# EAGLE design tracy (EAGLE 6.5.0)
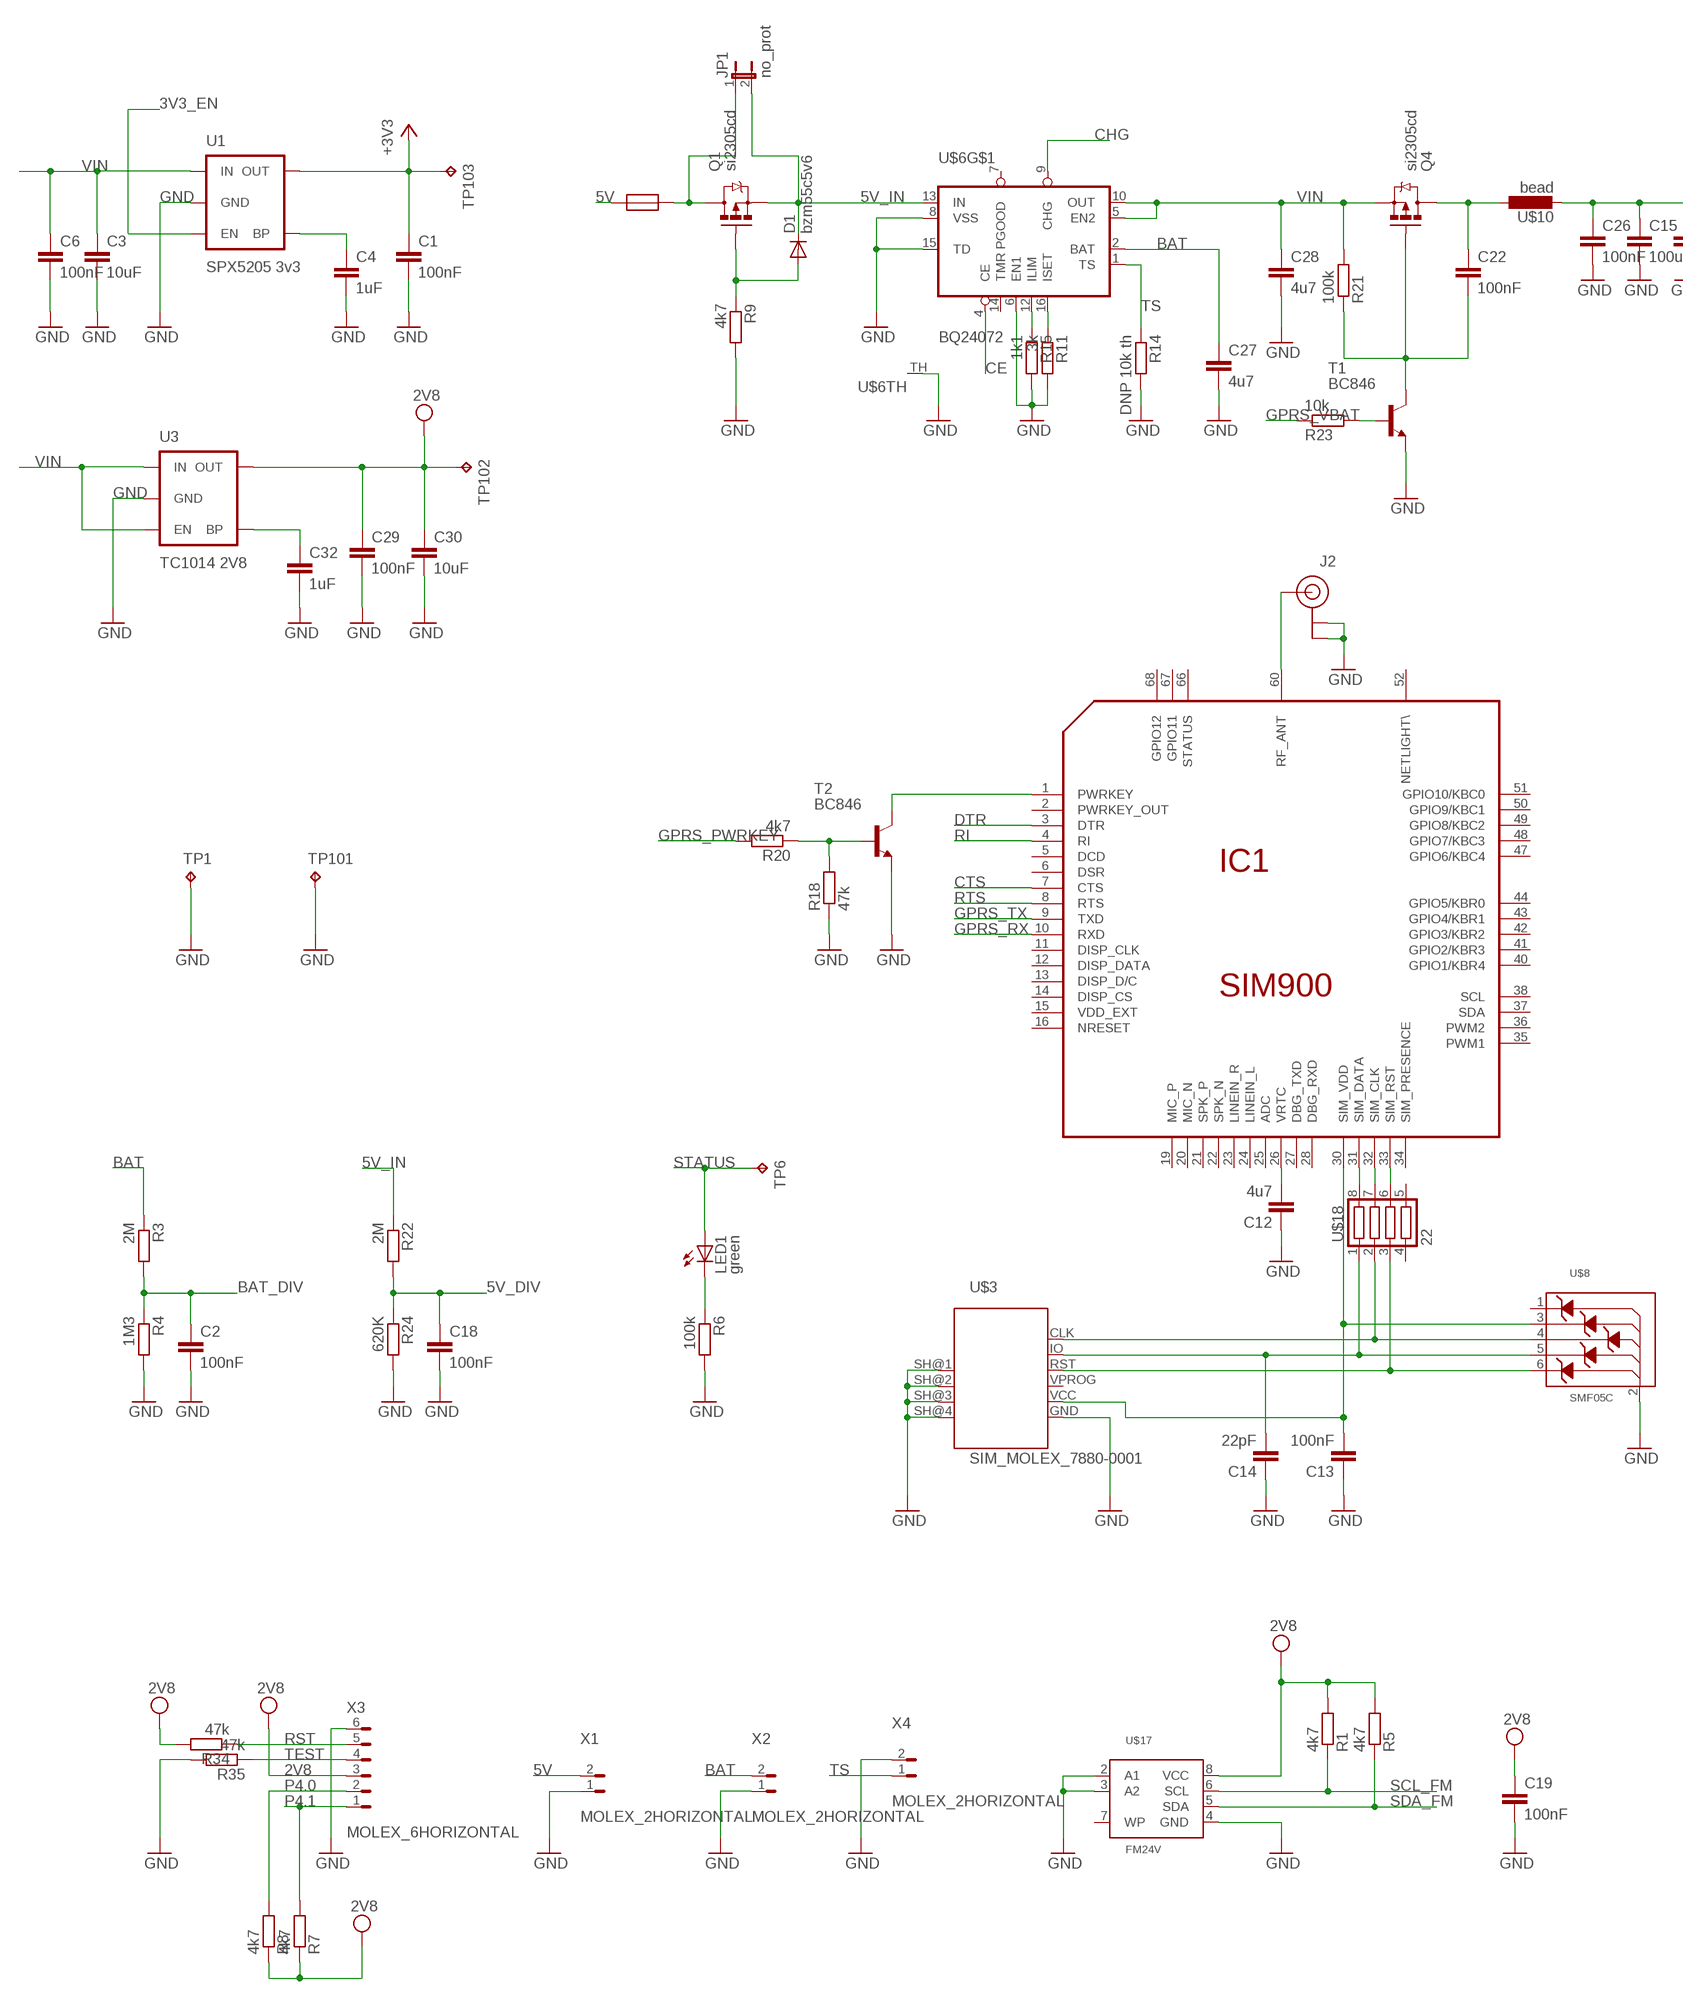
[diagram p0: schematic, sheet 1, part 1 of 2]
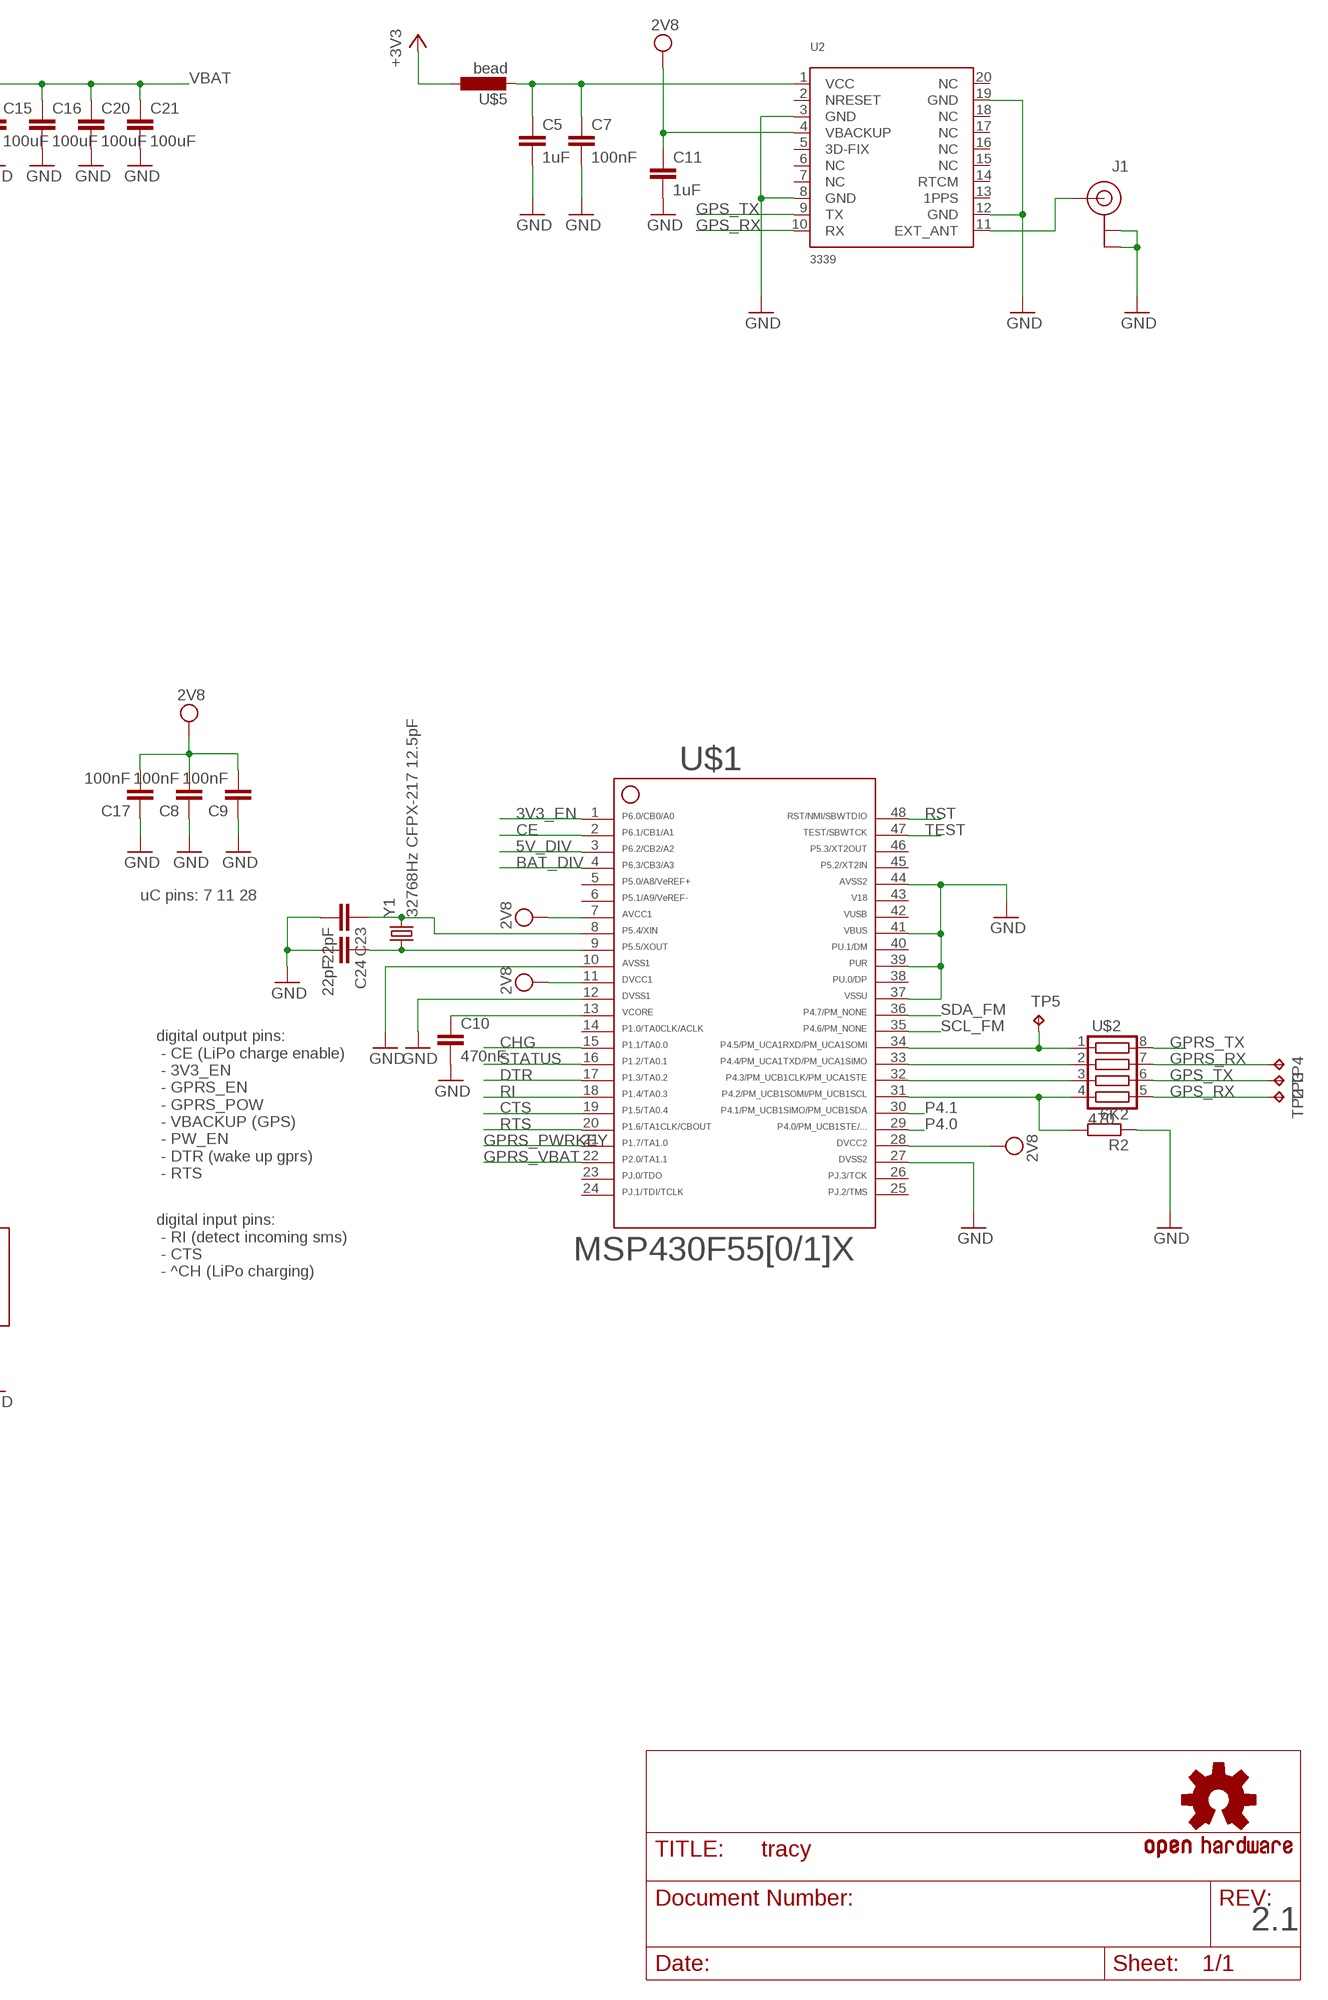
[diagram p1: schematic, sheet 1, part 2 of 2]

## Parts
C1  100nF  C-EUC0805  [C0805]
C2  100nF  C-EUC0805  [C0805]
C3  10uF  C-EUC0805  [C0805]
C4  1uF  C-EUC0805  [C0805]
C5  1uF  C-EUC0805  [C0805]
C6  100nF  C-EUC0805  [C0805]
C7  100nF  C-EUC0805  [C0805]
C8  100nF  C-EUC0805  [C0805]
C9  100nF  C-EUC0805  [C0805]
C10  470nF  C-EUC0805  [C0805]
C11  1uF  C-EUC0805  [C0805]
C12  4u7  C-EUC0805  [C0805]
C13  100nF  C-EUC0805  [C0805]
C14  22pF  C-EUC0805  [C0805]
C15  100uF  C-EUC1206  [C1206]
C16  100uF  C-EUC1206  [C1206]
C17  100nF  C-EUC0805  [C0805]
C18  100nF  C-EUC0805  [C0805]
C19  100nF  C-EUC0805  [C0805]
C20  100uF  C-EUC1206  [C1206]
C21  100uF  C-EUC1206  [C1206]
C22  100nF  C-EUC0805  [C0805]
C23  22pF  C-EUC0805  [C0805]
C24  22pF  C-EUC0805  [C0805]
C26  100nF  C-EUC0805  [C0805]
C27  4u7  C-EUC1206  [C1206]
C28  4u7  C-EUC1206  [C1206]
C29  100nF  C-EUC0805  [C0805]
C30  10uF  C-EUC1206  [C1206]
C32  1uF  C-EUC0805  [C0805]
D1  bzm55c5v6  DIODE-MICROMELF-W  [MICROMELF-W]
IC1  SIM900  [SIM900]
J1  U.FL  [U.FL]
J2  U.FL  [U.FL]
JP1  no_prot  JUMPER-2SMD-NO  [SJ_2S-NO]
LED1  green  LEDCHIPLED_0805  [CHIPLED_0805]
Q1  si2305cd  MOSFET-PCHANNELSMD_POWER  [SOT23-3_POWER]
Q4  si2305cd  MOSFET-PCHANNELSMD_POWER  [SOT23-3_POWER]
R1  4k7  R-EU_R0805W  [R0805W]
R2  6K2  R-EU_R0805W  [R0805W]
R3  2M  R-EU_R0805W  [R0805W]
R4  1M3  R-EU_R0805W  [R0805W]
R5  4k7  R-EU_R0805W  [R0805W]
R6  100k  R-EU_R0805W  [R0805W]
R7  4k7  R-EU_R0805W  [R0805W]
R8  4k7  R-EU_R0805W  [R0805W]
R9  4k7  R-EU_R0805W  [R0805W]
R11  3k  R-EU_R0805W  [R0805W]
R14  DNP 10k th  R-EU_R0805W  [R0805W]
R15  1k1  R-EU_R0805W  [R0805W]
R18  47k  R-EU_R0805W  [R0805W]
R20  4k7  R-EU_R0805W  [R0805W]
R21  100k  R-EU_R0805W  [R0805W]
R22  2M  R-EU_R0805W  [R0805W]
R23  10k  R-EU_R0805W  [R0805W]
R24  620K  R-EU_R0805W  [R0805W]
R34  47k  R-EU_R0805W  [R0805W]
R35  47k  R-EU_R0805W  [R0805W]
T1  BC846  [SOT23]
T2  BC846  [SOT23]
TP1  TPTP12R  [TP12R]
TP2  TPTP12R  [TP12R]
TP3  TPTP12R  [TP12R]
TP4  TPTP12R  [TP12R]
TP5  TPTP12R  [TP12R]
TP6  TPTP12R  [TP12R]
TP101  TPTP12R  [TP12R]
TP102  TPTP12R  [TP12R]
TP103  TPTP12R  [TP12R]
U1  SPX5205 3v3  V_REG_LDOSMD  [SOT23-5]
U2  3339  GPS_FGPMMOPA6H  [FGPMMOPA6H]
U3  TC1014 2V8  V_REG_LDOSMD  [SOT23-5]
U$1  MSP430F5510  F55[0/1]X---PT48  [PT48]
U$2  470  RES_ARR  [YC164]
U$3  SIM_MOLEX_7880-0001  [MOLEX_7880-0001]
U$5  bead  INDUCTOR  [L0805W]
U$6  BQ24072  [S-PVQFN-N16]
U$7  OSHW-LOGOM  [OSHW-LOGO-M]
U$8  SMF05C  [SC-88]
U$9  RESETTABLE_0805  [0805W]
U$10  bead  INDUCTOR  [L0805W]
U$17  FM24V  [SO-08]
U$18  22  RES_ARR  [YC164]
X1  MOLEX_2HORIZONTAL  [0530480210]
X2  MOLEX_2HORIZONTAL  [0530480210]
X3  MOLEX_6HORIZONTAL  [0530480610]
X4  MOLEX_2HORIZONTAL  [0530480210]
Y1  32768Hz CFPX-217 12.5pF  CRYSTAL3.2X1.5  [CRYSTAL-SMD-3.2X1.5]

## Nets
2V8: C8.2 C9.2 C11.1 C17.2 C19.1 C29.1 C30.1 R1.2 R5.2 R7.1 R8.1 R34.2 TP102.TP U2.4(VBACKUP) U3.5(OUT) U$1.7 U$1.11 U$1.28 U$17.8(VCC) X3.3
3V3_EN: U1.3(EN) U$1.1
5V: U$9.1 X1.2
5V_DIV: C18.1 R22.2 R24.1 U$1.3
5V_IN: D1.C JP1.2 Q1.2(S) R22.1 U$6.13(IN)
+3V3: C1.1 TP103.TP U1.5(OUT) U$5.1
BAT: C27.1 R3.1 U$6.2(BAT) X2.2
BAT_DIV: C2.1 R3.2 R4.1 U$1.4
CE: U$1.2 U$6.4(CE)
CHG: U$1.15 U$6.9(CHG)
CTS: IC1.7(CTS) U$1.19
DTR: IC1.3(DTR) U$1.17
GND: C1.2 C2.2 C3.2 C4.2 C5.2 C6.2 C7.2 C8.1 C9.1 C10.2 C11.2 C12.1 C13.1 C14.1 C15.2 C16.2 C17.1 C18.2 C19.2 C20.2 C21.2 C23.2 C24.2 C26.2 C27.2 C28.2 C29.2 C30.2 C32.2 J1.P$1(GND) J1.P$2(GND) J2.P$1(GND) J2.P$2(GND) R2.1 R4.2 R6.2 R9.2 R11.2 R14.2 R15.2 R18.1 R24.2 R35.2 T1.2(E) T2.2(E) TP1.TP TP101.TP U1.2(GND) U2.3(GND) U2.8(GND) U2.12(GND) U2.19(GND) U3.2(GND) U$1.10 U$1.12 U$1.27 U$1.37 U$1.39 U$1.41 U$1.44 U$3.GND U$3.SH@1(SH) U$3.SH@2(SH) U$3.SH@3(SH) U$3.SH@4(SH) U$6.6(EN1) U$6.8(VSS) U$6.15(TD) U$6.TH(TH:TH) U$8.2(ANODE) U$17.2(A1) U$17.3(A2) U$17.4(GND) X1.1 X2.1 X3.6 X4.2
GPRS_PWRKEY: R20.2 U$1.21
GPRS_RX: IC1.10(RXD) TP4.TP U$2.7
GPRS_TX: IC1.9(TXD) U$2.8
GPRS_VBAT: R23.1 U$1.22
GPS_RX: TP2.TP U2.10(RX) U$2.5
GPS_TX: TP3.TP U2.9(TX) U$2.6
GPS_VCC: C5.1 C7.1 U2.1(VCC) U$5.2
N$1: U$1.32 U$2.3
N$2: C4.1 U1.4(BP)
N$3: R2.2 U$1.31 U$2.4
N$4: U$1.33 U$2.2
N$5: JP1.1 Q1.3(D) U$9.2
N$6: C10.1 U$1.13
N$7: R23.2 T1.1(B)
N$8: LED1.C R6.1
N$9: J1.P$3(SIGNAL) U2.11(EXT_ANT)
N$10: TP5.TP U$1.34 U$2.1
N$11: D1.A Q1.1(G) R9.1
N$17: IC1.31(SIM_DATA) U$18.8
N$18: IC1.32(SIM_CLK) U$18.7
N$19: IC1.33(SIM_RST) U$18.6
N$25: C24.1 U$1.9 Y1.P$1
N$26: C23.1 U$1.8 Y1.P$2
N$27: R11.1 U$6.16(ISET)
N$33: R15.1 U$6.12(ILIM)
N$45: R18.2 R20.1 T2.1(B)
N$46: IC1.60(RF_ANT) J2.P$3(SIGNAL)
N$48: C22.2 Q4.1(G) R21.1 T1.3(C)
N$49: C22.1 Q4.3(D) U$10.1
N$50: C32.1 U3.4(BP)
P4.0: R8.2 U$1.29 X3.2
P4.1: R7.2 U$1.30 X3.1
PWRKEY: IC1.1(PWRKEY) T2.3(C)
RI: IC1.4(RI) U$1.18
RST: R34.1 U$1.48 X3.5
RTS: IC1.8(RTS) U$1.20
SCL_FM: R1.1 U$1.35 U$17.6(SCL)
SDA_FM: R5.1 U$1.36 U$17.5(SDA)
SIM_VCC: C13.2 IC1.30(SIM_VDD) U$3.VCC U$8.3(CATODE2)
SIMLOCK_CLK: U$3.CLK U$8.4(CATODE3) U$18.2
SIMLOCK_IO: C14.2 U$3.IO U$8.5(CATODE4) U$18.1
SIMLOCK_RST: U$3.RST U$8.6(CATODE5) U$18.3
STATUS: LED1.A TP6.TP U$1.16
TEST: R35.1 U$1.47 X3.4
TS: R14.1 U$6.1(TS) X4.1
VBAT: C15.1 C16.1 C20.1 C21.1 C26.1 U$10.2
VIN: C3.1 C6.1 C28.1 Q4.2(S) R21.2 U1.1(IN) U3.1(IN) U3.3(EN) U$6.5(EN2) U$6.10(OUT)
VRTC: C12.2 IC1.26(VRTC)
Unconnected: IC1.2(PWRKEY_OUT) IC1.5(DCD) IC1.6(DSR) IC1.11(DISP_CLK) IC1.12(DISP_DATA) IC1.13(DISP_D/C) IC1.14(DISP_CS) IC1.15(VDD_EXT) IC1.16(NRESET) IC1.19(MIC_P) IC1.20(MIC_N) IC1.21(SPK_P) IC1.22(SPK_N) IC1.23(LINEIN_R) IC1.24(LINEIN_L) IC1.25(ADC) IC1.27(DBG_TXD) IC1.28(DBG_RXD) IC1.34(SIM_PRESENCE) IC1.35(PWM1) IC1.36(PWM2) IC1.37(SDA) IC1.38(SCL) IC1.40(GPIO1/KBR4) IC1.41(GPIO2/KBR3) IC1.42(GPIO3/KBR2) IC1.43(GPIO4/KBR1) IC1.44(GPIO5/KBR0) IC1.47(GPIO6/KBC4) IC1.48(GPIO7/KBC3) IC1.49(GPIO8/KBC2) IC1.50(GPIO9/KBC1) IC1.51(GPIO10/KBC0) IC1.52(NETLIGHT\) IC1.66(STATUS) IC1.67(GPIO11) IC1.68(GPIO12) U2.2(NRESET) U2.5(3D-FIX) U2.6(NC) U2.7(NC) U2.13(1PPS) U2.14(RTCM) U2.15(NC) U2.16(NC) U2.17(NC) U2.18(NC) U2.20(NC) U$1.5 U$1.6 U$1.14 U$1.23 U$1.24 U$1.25 U$1.26 U$1.38 U$1.40 U$1.45 U$3.VPROG U$6.7(PGOOD) U$6.14(TMR) U$8.1(CATODE1) U$17.7(WP) U$18.4 U$18.5

## Notes on the sheet
- uC pins: 7 11 28
- digital output pins: 
   - CE (LiPo charge enable)
   - 3V3_EN
   - GPRS_EN
   - GPRS_POW
   - VBACKUP (GPS)
   - PW_EN
   - DTR (wake up gprs)
   - RTS
- digital input pins:
   - RI (detect incoming sms)
   - CTS
   - ^CH (LiPo charging)
- 2.1

## Power pins joined to a net without a drawn wire
42: U$1.42
43: U$1.43
46: U$1.46
GND: IC1.17(GND) IC1.18(GND) IC1.29(GND) IC1.39(GND) IC1.45(GND) IC1.46(GND) IC1.53(GND) IC1.54(GND) IC1.58(GND) IC1.59(GND) IC1.61(GND) IC1.62(GND) IC1.63(GND) IC1.64(GND) IC1.65(GND)
VBAT: IC1.55(VBAT) IC1.56(VBAT) IC1.57(VBAT)

## Library data of the parts
C1-C24 C26-C30 C32 = rcl:C-EU: CAPACITOR, European symbol
D1 = diode:DIODE-: DIODE
IC1 = Simplex-ICs:SIM900: SIM900
J1 J2 = SparkFun-Connectors:U.FL: SMD antenna connector- WRL-09144
JP1 = SparkFun-Passives:JUMPER-2: Jumper Basic 0.1" spaced jumper. Use with breakaway headers.
LED1 = led:LED: LED OSRAM: - CHIPLED LG R971, LG N971, LY N971, LG Q971, LY Q971, LO R971, LY R971 LH N974, LH R974 LS Q976, LO Q976, LY Q976 LO Q996 - Hyper CHIPLED LW Q18S LB Q993, LB Q99A, LB R99A - SideLED LS A670, LO A670, LY A670, LG A670, LP A670 LB A673, LV A673, LT A673, LW A673 LH A674 LY A675 LS A676, LA A676, LO A676, LY A676, LW A676 LS A679, LY A679, LG A679 - Hyper Micro SIDELED® LS Y876, LA Y876, LO Y876, LY Y876 LT Y87S - SmartLED LW L88C, LW L88S LB L89C, LB L89S, LG L890 LS L89K, LO L89K, LY L89K LS L896, LA L896, LO L896, LY L896 - TOPLED LS T670, LO T670, LY T670, LG T670, LP T670 LSG T670, LSP T670, LSY T670, LOP T670, LYG T670 LG T671, LOG T671, LSG T671 LB T673, LV T673, LT T673, LW T673 LH T674 LS T676, LA T676, LO T676, LY T676, LB T676, LH T676, LSB T676, LW T676 LB T67C, LV T67C, LT T67C, LS T67K, LO T67K, LY T67K, LW E67C LS E67B, LA E67B, LO E67B, LY E67B, LB E67C, LV E67C, LT E67C LW T67C LS T679, LY T679, LG T679 LS T770, LO T770, LY T770, LG T770, LP T770 LB T773, LV T773, LT T773, LW T773 LH T774 LS E675, LA E675, LY E675, LS T675 LS T776, LA T776, LO T776, LY T776, LB T776 LHGB T686 LT T68C, LB T68C - Hyper Mini TOPLED® LB M676 - Mini TOPLED Santana® LG M470 LS M47K, LO M47K, LY M47K Source: http://www.osram.convergy.de LUXEON: - LUMILED® LXK2-PW12-R00, LXK2-PW12-S00, LXK2-PW14-U00, LXK2-PW14-V00 LXK2-PM12-R00, LXK2-PM12-S00, LXK2-PM14-U00 LXK2-PE12-Q00, LXK2-PE12-R00, LXK2-PE12-S00, LXK2-PE14-T00, LXK2-PE14-U00 LXK2-PB12-K00, LXK2-PB12-L00, LXK2-PB12-M00, LXK2-PB14-N00, LXK2-PB14-P00, LXK2-PB14-Q00 LXK2-PR12-L00, LXK2-PR12-M00, LXK2-PR14-Q00, LXK2-PR14-R00 LXK2-PD12-Q00, LXK2-PD12-R00, LXK2-PD12-S00 LXK2-PH12-R00, LXK2-PH12-S00 LXK2-PL12-P00, LXK2-PL12-Q00, LXK2-PL12-R00 Source: www.luxeon.com KINGBRIGHT: KA-3528ASYC Source: www.kingbright.com
Q1 Q4 = Simplex-DiscreteSemi:MOSFET-PCHANNEL: Generic PMOSFET
R1-R9 R11 R14 R15 R18 R20-R24 R34 R35 = rcl:R-EU_: RESISTOR, European symbol
T1 T2 = transistor:BC846: NPN TRANSISTOR
TP1-TP6 TP101-TP103 = testpad:TP: Test pad
U1 U3 = SparkFun:V_REG_LDO: Voltage Regulator LDO Standard 150mA LDO voltage regulator in SOT-23 layout. Micrel part MIC5205. BP (by-pass) pin is used to lower output noise with 470pF cap.
U2 = Simplex-ICs:GPS_FGPMMOPA6H: GPS Module - MTK MT3339 Chipset, -165dBm sensitivity, 22 channels, 10Hz, auto-select external antenna options
U$1 = TI_MSP430_v16:F55[0/1]X---PT48: ***F55[0/1/2]X*** PT48 Rev. 1.0 06/2010 "http://www.ti.com/lit/gpn/msp430f5509" Only for FF5504, F5508,F5509,F5510
U$2 U$18 = Simplex-rlc:RES_ARR: resistor chip array yageo YC164 series (8pin/4R)
U$3 = Simplex-Connectors:SIM: SIM card holders without lock detection
U$5 U$10 = Simplex-rlc:INDUCTOR: smd inductors
U$6 = Simplex-ICs:BQ24072: TI BQ24072 - Li battery charger and power path management ic
U$7 = SparkFun:OSHW-LOGO: Open Source Hardware Logo This logo indicates the piece of hardware it is found on incorporates a OSHW license and/or adheres to the definition of open source hardware found here: http://freedomdefined.org/OSHW
U$8 = Simplex-DiscreteSemi:SMF05C: ON Semiconductor SMF05C 5-line transient voltage suppressor array
U$9 = Simplex-Fuses:RESETTABLE: resettable fuse
U$17 = Simplex-ICs:FM24V: CYPRESS FM24Vxx serial f-ram
X1 X2 X4 = Simplex-Connectors:MOLEX_2: Molex 2 pin connectors 1.25mm PicoBlade
X3 = Simplex-Connectors:MOLEX_6: Molex 6 pin connectors 1.25mm PicoBlade
Y1 = Simplex-FreqCtrl:CRYSTAL: smd crystals

## Net classes
1 vcc: width 0.203 mm

## Board
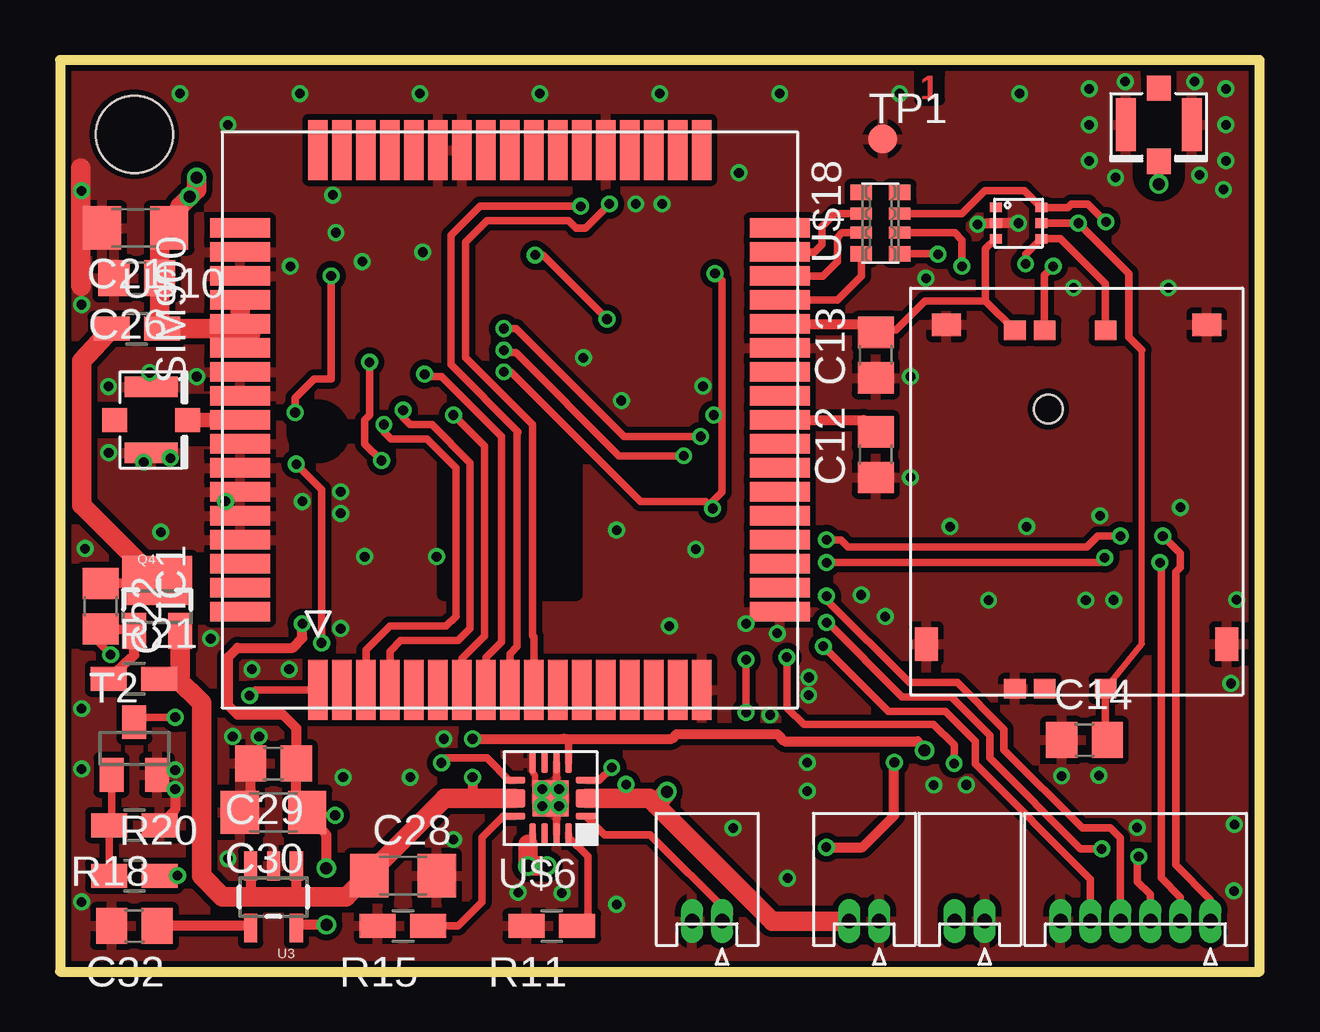
[diagram p2: board, top side]
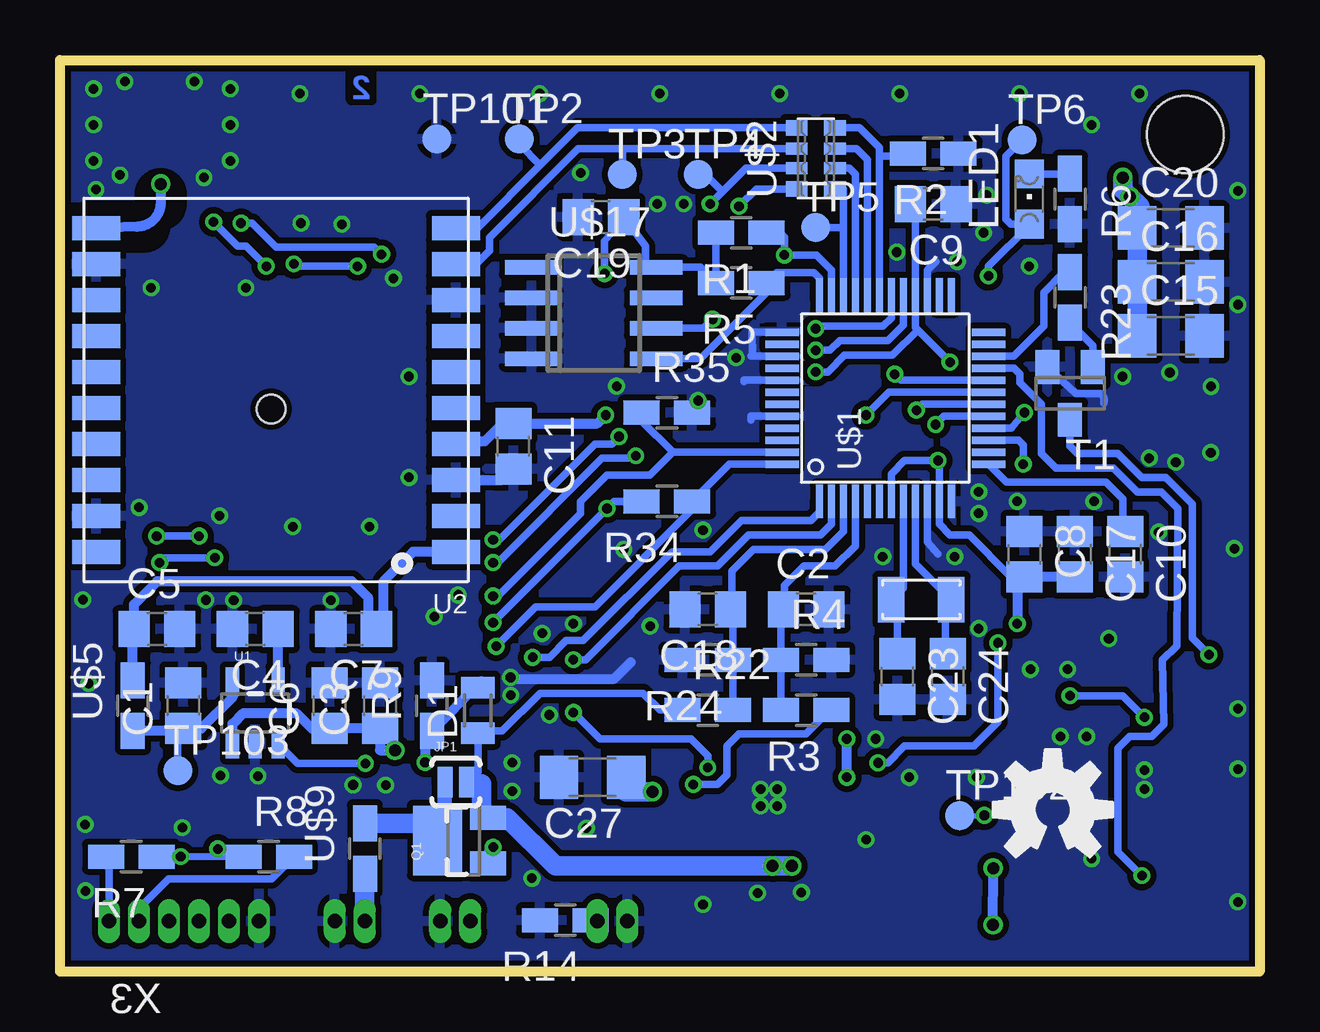
[diagram p3: board, bottom side, seen from below]

Size 50 x 38 mm. Coordinates in mm from the lower left corner, seen from the top.
Outline: 0,0 50,0 50,38 0,38 0,0
Copper layers (1*16): Top 0.035mm / dielectric 1.5mm / Bottom 0.035mm
Design rules "seeedstudio_rules_v1.1 *": minimum track width 6mil, minimum drill 12mil, track to track 6mil, track to pad 6mil, pad to pad 6mil, via to via 6mil, smd to smd 0mil, copper to edge 10mil, drill to drill 10mil, minimum pad ring 0.154mm, minimum via ring 6mil, stop-mask expansion 2mil, vias tented up to drill 100mil, thermal gap 10mil
Holes 3.2 mm at 3.1,34.9
tRestrict: 2 lines
bRestrict: 2 lines

### Footprints (pad centres in the part's own frame; a part is rotated, then mirrored left to right if it is on the bottom)
C0805 = smd 1.3 x 1.5: 1 -0.95,0; 2 0.95,0
C1206 = smd 1.6 x 1.8: 1 -1.4,0; 2 1.4,0
MICROMELF-W = smd 0.9 x 1.4: A 0.95,0; C -0.95,0
SIM900 = smd 2.5 x 0.8: 1 -11.25,8; 2 -11.25,7; 3 -11.25,6; 4 -11.25,5; 5 -11.25,4; 6 -11.25,3; 7 -11.25,2; 8 -11.25,1; 9 -11.25,0; 10 -11.25,-1; 11 -11.25,-2; 12 -11.25,-3; 13 -11.25,-4; 14 -11.25,-5; 15 -11.25,-6; 16 -11.25,-7; 17 -11.25,-8; 35 11.25,-8; 36 11.25,-7; 37 11.25,-6; 38 11.25,-5; 39 11.25,-4; 40 11.25,-3; 41 11.25,-2; 42 11.25,-1; 43 11.25,0; 44 11.25,1; 45 11.25,2; 46 11.25,3; 47 11.25,4; 48 11.25,5; 49 11.25,6; 50 11.25,7; 51 11.25,8 | smd 0.8 x 2.5: 18 -8,-11.25; 19 -7,-11.25; 20 -6,-11.25; 21 -5,-11.25; 22 -4,-11.25; 23 -3,-11.25; 24 -2,-11.25; 25 -1,-11.25; 26 0,-11.25; 27 1,-11.25; 28 2,-11.25; 29 3,-11.25; 30 4,-11.25; 31 5,-11.25; 32 6,-11.25; 33 7,-11.25; 34 8,-11.25; 52 8,11.25; 53 7,11.25; 54 6,11.25; 55 5,11.25; 56 4,11.25; 57 3,11.25; 58 2,11.25; 59 1,11.25; 60 0,11.25; 61 -1,11.25; 62 -2,11.25; 63 -3,11.25; 64 -4,11.25; 65 -5,11.25; 66 -6,11.25; 67 -7,11.25; 68 -8,11.25
U.FL = smd 2.2 x 0.85: P$1 0,1.375; P$2 0,-1.375 | smd 1.05 x 1: P$3 1.525,0; P$4 -1.525,0
SJ_2S-NO = smd 0.635 x 1.27: 1 -0.45,0; 2 0.45,0
CHIPLED_0805 = smd 1.2 x 1.2: A 0,-1.05; C 0,1.05
SOT23-3_POWER = smd 1 x 1.5: 1 -0.939,-1.384; 2 0.961,-1.384 | smd 2.9 x 2.05: 3 0.011,0.716
R0805W = smd 1.5 x 1: 1 -1.052,0; 2 1.052,0
SOT23 = smd 1 x 1.4: 1 -0.95,-1.1; 2 0.95,-1.1; 3 0,1.1
TP12R = smd 1.2 x 1.2: TP 0,0
SOT23-5 = smd 0.55 x 1.2: 1 -0.95,-1.3; 2 0,-1.3; 3 0.95,-1.3; 4 0.95,1.3; 5 -0.95,1.3
FGPMMOPA6H = smd 2 x 1: 1 0.5,14.75; 2 0.5,13.25; 3 0.5,11.75; 4 0.5,10.25; 5 0.5,8.75; 6 0.5,7.25; 7 0.5,5.75; 8 0.5,4.25; 9 0.5,2.75; 10 0.5,1.25; 11 15.5,1.25; 12 15.5,2.75; 13 15.5,4.25; 14 15.5,5.75; 15 15.5,7.25; 16 15.5,8.75; 17 15.5,10.25; 18 15.5,11.75; 19 15.5,13.25; 20 15.5,14.75 | hole 1.2: 8.2,8.8
PT48 = smd 1.4 x 0.3: 1 -4.3,2.75; 2 -4.3,2.25; 3 -4.3,1.75; 4 -4.3,1.25; 5 -4.3,0.75; 6 -4.3,0.25; 7 -4.3,-0.25; 8 -4.3,-0.75; 9 -4.3,-1.25; 10 -4.3,-1.75; 11 -4.3,-2.25; 12 -4.3,-2.75; 25 4.3,-2.75; 26 4.3,-2.25; 27 4.3,-1.75; 28 4.3,-1.25; 29 4.3,-0.75; 30 4.3,-0.25; 31 4.3,0.25; 32 4.3,0.75; 33 4.3,1.25; 34 4.3,1.75; 35 4.3,2.25; 36 4.3,2.75 | smd 0.3 x 1.4: 13 -2.75,-4.3; 14 -2.25,-4.3; 15 -1.75,-4.3; 16 -1.25,-4.3; 17 -0.75,-4.3; 18 -0.25,-4.3; 19 0.25,-4.3; 20 0.75,-4.3; 21 1.25,-4.3; 22 1.75,-4.3; 23 2.25,-4.3; 24 2.75,-4.3; 37 2.75,4.3; 38 2.25,4.3; 39 1.75,4.3; 40 1.25,4.3; 41 0.75,4.3; 42 0.25,4.3; 43 -0.25,4.3; 44 -0.75,4.3; 45 -1.25,4.3; 46 -1.75,4.3; 47 -2.25,4.3; 48 -2.75,4.3
YC164 = smd 0.65 x 0.9: 1 -1.275,-0.8; 4 1.275,-0.8; 5 1.275,0.8; 8 -1.275,0.8 | smd 0.5 x 0.9: 2 -0.4,-0.8; 3 0.4,-0.8; 6 0.4,0.8; 7 -0.4,0.8
MOLEX_7880-0001 = smd 0.8 x 0.9: CLK 1.77,8.13; GND 16.71,4.35; IO 16.71,8.13; RST 1.77,5.59; VCC 1.77,4.35; VPROG 16.71,5.59 | smd 0.95 x 1.2: SH@1 1.54,1.5; SH@4 1.54,12.35 | smd 1.4 x 0.95: SH@2 14.85,0.66; SH@3 14.85,13.18
L0805W = smd 1.5 x 1: 1 -1.052,0; 2 1.052,0
S-PVQFN-N16 = smd 0.85 x 0.28: 1 -0.725,2.225; 4 -0.725,0.725; 9 2.225,0.725; 12 2.225,2.225 | smd 0.85 x 0.78: 2 -0.725,1.475; 10 2.225,1.475 | smd 0.28 x 0.85: 5 0,0; 6 0.5,0; 7 1,0; 8 1.5,0; 13 1.5,2.95; 14 1,2.95; 15 0.5,2.95; 16 0,2.95 | smd 1.5 x 1.5: TH 0.75,1.475
SC-88 = smd 0.5 x 0.4: 1 0,1.3; 2 0,0.65; 3 0,0; 4 1.9,0; 5 1.9,0.65; 6 1.9,1.3
0805W = smd 1.5 x 1: 1 -1.052,0; 2 1.052,0
SO-08 = smd 0.6 x 2.2: 1 -1.905,-2.6; 2 -0.635,-2.6; 3 0.635,-2.6; 4 1.905,-2.6; 5 1.905,2.6; 6 0.635,2.6; 7 -0.635,2.6; 8 -1.905,2.6
0530480210 = drill 0.6 pad 0.9 long: 1 0,0; 2 1.25,0
0530480610 = drill 0.6 pad 0.9 long: 1 0,0; 2 1.25,0; 3 2.5,0; 4 3.75,0; 5 5,0; 6 6.25,0
CRYSTAL-SMD-3.2X1.5 = smd 1.1 x 1.9: P$1 -1.25,0; P$2 1.25,0

### Placement (x,y rotation side)
C1  44.86,11.08 90 bottom
C2  18.9,15.1 0 bottom
C3  36.66,11.08 90 bottom
C4  41.86,14.28 180 bottom
C5  45.96,14.28 0 bottom
C6  38.76,11.08 90 bottom
C7  37.76,14.28 180 bottom
C8  9.8,17.4 270 bottom
C9  13.6,32 180 bottom
C10  5.6,17.4 270 bottom
C11  31.1,21.9 270 bottom
C12  34,21.55 90 top
C13  34,25.7 90 top
C14  42.7,9.65 0 top
C15  3.7,26.5 0 bottom
C16  3.7,28.75 0 bottom
C17  7.7,17.4 270 bottom
C18  23,15.1 180 bottom
C19  27.45,31.45 180 bottom
C20  3.7,31 0 bottom
C21  3.15,31 180 top
C22  1.7,15.23 270 top
C23  15.1,12.3 270 bottom
C24  13,12.3 270 bottom
C26  3.2,28.9 180 top
C27  27.8,8.1 180 bottom
C28  14.3,4 0 top
C29  8.9,8.67 180 top
C30  8.9,6.64 180 top
C32  3.1,1.9 180 top
D1  32.58,10.89 90 bottom
IC1  18.75,23 90 top
J1  45.8,35.3 270 top
J2  3.8,23 0 top
JP1  33.5,7.9 0 bottom
LED1  9.6,32.2 0 bottom
Q1  33.55,5.45 90 bottom
Q4  4.04,15.59 0 top
R1  21.6,30.8 180 bottom
R2  13.6,34.1 180 bottom
R3  18.9,10.9 180 bottom
R4  18.9,13 0 bottom
R5  21.6,28.7 180 bottom
R6  7.9,32.2 270 bottom
R7  47.03,4.79 180 bottom
R8  41.3,4.79 0 bottom
R9  34.5,11.08 90 bottom
R11  20.5,1.9 180 top
R14  28.94,2.14 180 bottom
R15  14.3,1.9 180 top
R18  3.1,6.1 180 top
R20  3.1,4 0 top
R21  3.09,12.2 0 top
R22  23,10.9 0 bottom
R23  7.9,28.1 270 bottom
R24  23,13 180 bottom
R34  24.7,19.6 180 bottom
R35  24.7,23.3 0 bottom
T1  7.9,24.1 180 bottom
T2  3.1,9.3 0 top
TP1  34.3,34.7 0 top
TP2  30.85,34.7 0 bottom
TP3  26.56,33.23 0 bottom
TP4  23.39,33.23 0 bottom
TP5  18.5,31.02 0 bottom
TP6  9.9,34.67 0 bottom
TP101  34.3,34.7 0 bottom
TP102  12.5,6.5 0 bottom
TP103  45.09,8.37 0 bottom
U1  41.86,10.78 0 bottom
U2  33,32.25 180 bottom
U3  8.9,3.11 180 top
U$1  15.6,23.9 90 bottom
U$2  18.5,33.9 90 bottom
U$3  35.45,28.5 270 top
U$5  46.96,11.08 90 bottom
U$6  21.2,8.7 180 top
U$7  8.62,6.75 0 bottom
U$8  39,30.55 0 top
U$9  37.29,5.13 90 bottom
U$10  3.2,26.8 0 top
U$17  27.75,27.45 270 bottom
U$18  34.2,31.2 90 top
X1  38.55,2.1 180 top
X2  34.15,2.1 180 top
X3  47.95,2.1 180 top
X4  27.6,2.1 180 top
Y1  14.1,15.5 180 bottom

### Tracks (layer width: path | path; a pad name or v marks a point on that pad's centre or on a via)
2V8  (via drill 0.4, 0.5)
  Top 0.254: v11.47,6.51 C30.1
  Top 0.305: v12.9,25.4 12.9,23.2 12.7,23 12.7,22 v13.4,21.3 | v18.5,25 18.8,25 24.2,19.6 26.9,19.6 v27.2,19.3 27.2,19.6 27.6,20 27.6,22.95 | 27.6,22.95 27.6,28.8 v27.3,29.1 | v31.95,14.55 32,14.55 35.1,11.45 37.15,11.45 38.75,9.85 38.75,8.9 42.54,5.11 v43.42,5.11 | v27.25,23.2 27.35,23.2 27.6,22.95 | X3.3 45.44,3.21 44.91,3.74 44.91,4.79 v44.97,4.79
  Top 0.406: v10.1,14.5 10.1,13.9 9.7,13.5 7.4,13.5 7,13.1 7,11.1 7.4,10.7 9.3,10.7 9.85,10.15 C29.1 9.85,6.95 | C30.1 11.1,5.7 v11.1,4.31 | v11.11,1.95 9.99,1.95 U3.5
  Top 0.61: C30.1 9.85,6.95
  Bottom 0.254: TP102.TP v11.47,6.51
  Bottom 0.305: 14.25,26.75 14.35,26.85 U$1.28 14.35,32.1 C9.2 | 14.25,26.75 v12.9,25.4 | U$1.7 15.35,20.75 14.8,21.3 v13.4,21.3 13.35,21.3 U$1.11 13.35,18.65 12.9,18.2 12.1,18.2 10.4,16.5 9.85,16.5 C8.2 | v18.5,25 18,25 17.3,25.7 15.3,25.7 14.25,26.75 | R34.2 26.9,19.6 v27.2,19.3 v31.95,14.55 | R1.2 R5.2 23.31,29.36 U$17.8 25.6,29.3 25.6,30.25 C19.1 27.3,30.45 v27.3,29.1 | 43.45,4.8 v44.97,4.79 R7.1 | R8.1 43.45,4.8 | 43.45,4.8 43.42,4.83 v43.42,5.11
  Bottom 0.406: C17.2 C8.2 10.1,16.15 v10.1,14.5 | v11.11,1.95 v11.1,4.31 | U2.4 33.4,22.1 32.3,22.1 31.55,22.85 C11.1 27.6,22.85 v27.25,23.2
3V3_EN  (via drill 0.4)
  Top 0.305: v30.3,13.1 30.3,11 31,10.3 36.41,10.31 37.28,9.44 v37.27,8.67
  Bottom 0.305: U$1.1 18.35,19.15 18.7,18.8 21.6,18.8 22.9,17.5 24.5,17.5 28.2,13.8 28.9,13.8 29.6,13.1 v30.3,13.1 29.9,13.1 | v37.27,8.67 40.1,8.67 U1.3
5V
  Bottom 0.813: U$9.1 37.3,4.07 X1.2
5V_DIV
  Bottom 0.305: R22.2 R24.1 21.95,15 C18.1 22,15.15 22,16.7 21.1,17.6 18.1,17.6 17.35,18.35 U$1.3
5V_IN  (via drill 0.5)
  Top 0.305: 19.5,5.3 19.5,5.55 19.7,5.55 U$6.13
  Top 0.813: 19.5,5.3 v19.5,4.4 20,4.4
  Bottom 0.305: R22.1 25,10.9 25.7,11.6 30,11.6 31.57,10.03 32.48,10.03 D1.C 32.58,8.32 JP1.2
  Bottom 0.406: 32.43,6.46 Q1.2 | JP1.2 32.43,7.82
  Bottom 0.813: v19.5,4.4 v20.3,4.4 29.35,4.4 31.36,6.41 Q1.2 | 32.43,6.46 32.43,7.82
+3V3
  Bottom 0.305: TP103.TP 45.09,9.9 C1.1
  Bottom 0.406: U1.5 42.81,11.43 44.11,10.13 C1.1 44.96,10.03 U$5.1
BAT  (via drill 0.4, 0.5)
  Top 0.305: U$6.2 23.6,7.22 v23.6,7.8
  Top 0.813: U$6.2 24.57,7.22 24.85,6.95 | v25.3,7.5 24.85,6.95 | X2.2 29.7,2.1 24.85,6.95
  Bottom 0.305: R3.1 17.9,10.9 18.9,9.9 21.7,9.9 22.2,9.4 22.2,8.2 22.6,7.8 v23.6,7.8
  Bottom 0.813: C27.1 26.4,7.5 v25.3,7.5
BAT_DIV
  Bottom 0.305: R3.2 R4.1 19.95,15 C2.1 19.8,15.15 19.8,16.1 19,16.9 17.7,16.9 16.85,17.75 U$1.4
CE  (via drill 0.4)
  Top 0.305: U$6.4 22.48,7.97 v23,8.5 | v28.6,13 v28.6,10.8
  Bottom 0.305: U$1.2 17.85,18.65 18.3,18.2 21.3,18.2 22.6,16.9 24.2,16.9 28.1,13 v28.6,13 | v23,8.5 23,9 23.7,9.7 27.5,9.7 v28.6,10.8
CHG  (via drill 0.4)
  Top 0.305: v10.9,13.7 10.9,20.1 v9.85,21.15 | U$6.9 18.73,7.97 17.8,8.9 16.1,8.9 v15.9,8.7
  Bottom 0.305: U$1.15 10.05,22.15 9.85,21.95 v9.85,21.15 | v10.9,13.7 10.9,10.4 11.9,9.4 14.8,9.4 15.5,8.7 v15.9,8.7
CTS  (via drill 0.4)
  Top 0.305: v16.4,23.2 17.7,21.9 17.7,14 16.75,13.05 IC1.7
  Bottom 0.305: U$1.19 15.45,24.15 v16.4,23.2
DTR  (via drill 0.4)
  Top 0.305: v13.5,22.8 13.5,22.5 13.8,22.2 15.3,22.2 16.5,21 16.5,14.8 16.1,14.4 13.75,14.4 12.75,13.4 IC1.3
  Bottom 0.305: U$1.17 13.15,23.15 v13.5,22.8
GND  (via drill 0.4)
  Top 0.254: U$6.8 19.7,8.3 19.8,8.2 19.8,7.88 20,7.67
  Top 0.305: U$6.15 20.7,7.22 U$6.TH | U$6.TH 20,7.67 20,7.7 v20.1,7.6 20.4,7.3 | U$6.6 20.7,7.47 U$6.TH
  Top 0.406: C30.2 7.95,6.95 C29.2 | v4.8,7.6 4.8,6.75 R18.1 | v4.8,8.4 4.25,8.4 T2.2 | v39.95,31.2 U$8.2 38.25,31.2 38.2,31.15
  Top 0.813: 0.87,33.5 0.87,28.6 0.88,28.6 0.88,28.58
  Bottom 0.305: 13.4,17.4 13.85,17.9 U$1.10 13.85,19.7 | U$1.44 21.2,23.15 21.2,23 | U$1.27 13.85,29.25 13.5,29.6 | U$1.41 21.5,24.65 21.5,24.6 | U$1.39 21.19,25.65 | U$1.37 21.15,26.65 21.14,25.67 | T1.2 7.65,24.1 6.65,24.1 arc90 6.5,23.7
  Bottom 0.406: 31.28,12.2 26.9,12.2 26.2,12.9 | U2.3 31.55,20.5 C11.2
  other vias: 35,36.6 8.3,9.8 40,36.6 20.8,7.6 20.8,6.9 20.1,6.9 19.1,3.3 5.7,24.8 2.02,24.39 7.2,9.8 7,4.7 28.3,33.3 30,36.6 44,33.1 48.6,36.8 47.5,33.2 42.9,36.8 24,32 25.4,14.4 26.5,17.6 29.6,10.7 10.1,19.6 9.6,29.4 6.9,19.6 6.28,13.88 11.7,14.3 0.9,10.96 4.2,18.32 2.03,21.63 11.5,30.8 7,35.3 15,36.6 25,36.6 23.4,23.8 29.9,14.1 16.4,5.5 20.92,3.27 11.7,19.1 12.6,29.6 36.42,7.77 23.2,2.8 23.2,18.4 31.15,7.52 44.4,37.1 28.6,14.5 47.3,37.1 48.5,32.6 42.9,35.3 48.6,35.3 10,36.6 20,36.6 5,36.6 26.8,24.4 0.9,8.44 0.9,2.9 11.7,20 12.7,17.3 11.37,32.37 25.1,32 21.82,25.59 8,12.6 9.55,12.6 11.8,8.1 14.6,8.1 16,9.7 42.9,33.8 48.6,33.8 3.74,24.97 3.49,21.23 0.9,27.8 0.9,32.55 4.6,21.4 15.7,17.3 31.21,11.52 31.22,12.26 33.4,15.7 34.4,14.8 42.76,15.48 38.71,15.48 43.92,15.49 37.1,18.55 40.3,18.55 43.35,19 41.75,8.15 43.31,8.17 44.9,6 48.95,6.13 48.81,12.01 49.05,15.5 30.33,3.89 37.78,7.78 36.1,28.9 38.25,31.15 46.2,28.5 35.45,24.8 35.45,20.6 46.7,19.35 42.25,28.5 28.06,5.98 48.93,3.36 31.15,8.71 15.12,29.99 1.05,17.63
  pour Top (isolate 0.254): 0,38 50,38 50,0 0,0
  pour Bottom (isolate 0.254): 0,38 50,38 50,0 0,0
GPRS_PWRKEY  (via drill 0.4)
  Top 0.305: R20.2 v4.9,4
  Bottom 0.305: v4.9,4 5.9,5 5.9,9.3 5.4,9.8 4.5,9.8 4,10.3 4.05,12.98 3.45,13.58 3.4,19.3 4.1,20 5.1,20 6.1,21 8.5,21 9.1,21.6 9.1,23.65 10,24.55 10,24.9 10.25,25.15 U$1.21
GPRS_RX  (via drill 0.4)
  Top 0.305: v22.9,32 21.9,31 21.5,31 21.2,31.3 17.8,31.3 16.9,30.4 16.9,25.6 19.7,22.8 19.7,14 19.75,13.95 IC1.10
  Bottom 0.305: U$2.7 21.4,33.5 22.39,32.52 | 22.39,32.52 v22.9,32 | TP4.TP 23.11,33.24 22.39,32.52
GPRS_TX  (via drill 0.4)
  Top 0.305: v21.7,31.9 17.5,31.9 16.3,30.7 16.3,25.3 19.1,22.5 19.05,22.45 19.05,13.55 18.75,13.25 IC1.9
  Bottom 0.305: U$2.8 20.98,32.62 v21.7,31.9
GPRS_VBAT
  Bottom 0.305: U$1.22 10.25,25.65 9,26.9 9,28.3 8.15,29.15 R23.1 7.95,29.2
GPS_RX
  Bottom 0.305: U$2.5 28.43,35.17 29.98,33.62 | 29.98,33.62 32.6,31 U2.10 | TP2.TP 30.85,34.48 29.98,33.62
GPS_TX
  Bottom 0.305: U$2.6 26.59,34.3 | 26.59,34.3 28.4,34.3 32.1,30.6 32.1,30.05 32.7,29.45 33.45,29.45 U2.9 | TP3.TP 26.56,34.27 26.59,34.3
GPS_VCC
  Bottom 0.406: 47.26,12.03 46.96,11.73 U$5.2 46.96,14.23 C5.1 46.91,15.31 45.95,16.27 37.83,16.27 37.16,15.6 37.16,14.63 C7.1 | 36.81,14.58 C7.1 | U2.1 35.29,17.5 36.53,16.26 36.53,14.56 C7.1
N$1
  Bottom 0.305: U$1.32 16.35,33.85 16.8,34.3 U$2.3
N$2
  Bottom 0.406: U1.4 C4.1
N$3
  Bottom 0.305: U$2.4 16.68,35.17 15.85,34.35 15.85,34 | U$1.31 15.85,34 | R2.2 14.65,34 15.85,34
N$4
  Bottom 0.305: U$1.33 16.85,33.25 17.1,33.5 U$2.2
N$5
  Bottom 0.61: JP1.1 33.98,5.75 Q1.3
  Bottom 0.813: U$9.2 35.2,6.18 Q1.3
N$6
  Bottom 0.305: 6,18.75 C10.1 5.7,18.45 5.7,19.7 6.4,20.4 10.55,20.4 U$1.13
N$7
  Bottom 0.305: R23.2 6.95,26.1 T1.1
N$8
  Bottom 0.305: R6.1 LED1.C
N$9  (via drill 0.5)
  Top 0.406: v45.8,32.83 J1.P$3
  Bottom 0.406: U2.11 46.8,31.05 arc-90 45.8,32.05 v45.8,32.83
N$10
  Bottom 0.305: U$1.34 17.35,30.95 17.35,31.02 | 17.35,31.02 17.35,32.62 U$2.1 | TP5.TP 17.35,31.02
N$11  (via drill 0.4)
  Top 0.406: v31.94,5.18 33.45,5.18 34.77,6.5 v34.77,8.71 v34.78,8.72
  Bottom 0.305: D1.A 32.58,12.02 32.54,11.98
  Bottom 0.406: Q1.1 32.15,4.93 v31.94,5.18 | 32.43,12.1 32.54,11.98 R9.1 34.5,9.68 34.78,9.4 v34.78,8.72
N$17
  Top 0.305: IC1.31 32.4,28 33.4,29 U$18.8
N$18
  Top 0.305: IC1.32 31.8,29 32.4,29.6 32.4,30.6 32.6,30.8 U$18.7
N$19
  Top 0.305: IC1.33 31.45,30 31.75,30.3 31.75,31.05 32.3,31.6 U$18.6
N$25
  Bottom 0.305: U$1.9 14.35,17 Y1.P$1 13.1,15.25 13.1,13.35 C24.1
N$26
  Bottom 0.305: U$1.8 14.85,16 Y1.P$2 15.1,15.25 C23.1
N$27
  Top 0.305: U$6.16 21.2,5.6 22,4.8 22,2.35 R11.1
N$33
  Top 0.305: R15.1 16.6,1.9 17.6,2.9 17.6,5.6 18.48,6.47 U$6.12
N$45
  Top 0.305: T2.1 2.15,6.2 R18.2 R20.1
N$46
  Top 0.61: IC1.60 J2.P$3
N$48  (via drill 0.4)
  Top 0.305: R21.1 2.1,11.87 | v2.11,13.21 1.5,13.82 C22.2
  Top 0.406: C22.2 2.97,14.27 Q4.1 3.1,13.19 2.97,13.06 R21.1
  Bottom 0.305: T1.3 7.9,21.9 7.6,21.6 5.9,21.6 4.9,20.6 3.9,20.6 2.8,19.5 2.8,13.9 v2.11,13.21
N$49
  Top 0.406: Q4.3 3.79,16.17 C22.1
  Top 0.813: Q4.3 0.9,19.46 0.9,25.45 U$10.1
N$50
  Top 0.305: C32.1 4.35,1.6
  Top 0.406: U3.4 7.86,1.9 C32.1
P4.0  (via drill 0.4)
  Top 0.254: v18.5,25.9 18.6,25.8
  Top 0.305: 18.6,25.8 19,25.8 23.3,21.5 v26,21.5 | X3.2 46.7,3.1 45.9,3.9 45.9,17.05 v45.85,17.05 | v31.95,17.05 43.35,17.05 v43.55,17.25
  Bottom 0.305: U$1.29 14.85,26.95 15.5,26.3 17.5,26.3 17.9,25.9 v18.5,25.9 | v26,21.5 26.1,21.4 27.4,21.4 31.75,17.05 v31.95,17.05 | v43.55,17.25 45.65,17.25 v45.85,17.05 | X3.2 46.7,2.63 45.47,3.86 41.18,3.86 R8.2
P4.1  (via drill 0.4)
  Top 0.305: v18.5,26.8 19,26.8 23.5,22.3 v26.7,22.3 | X3.1 47.95,3 46.5,4.45 46.5,16.65 46.7,16.85 46.7,17.42 v45.97,18.15 | v31.95,18 32.55,18 32.85,17.7 42.8,17.7 43.25,18.15 v44.2,18.15
  Bottom 0.305: U$1.30 15.35,27.25 15.7,26.9 18.4,26.9 v18.5,26.8 | v26.7,22.3 27,22 27.7,22 31.7,18 v31.95,18 | v44.2,18.15 v45.97,18.15 | R7.2 47.95,4.2 X3.1
PWRKEY  (via drill 0.4)
  Top 0.305: IC1.1 8.15,11.75 v7.9,11.5 | v4.8,10.6 3.3,10.6 T2.3
  Bottom 0.305: v4.8,10.6 5.7,11.5 v7.9,11.5
RI  (via drill 0.4)
  Top 0.305: v14.3,23.4 14.3,23.1 14.6,22.8 15.5,22.8 17.1,21.2 17.1,14.3 16.6,13.8 14.2,13.8 13.75,13.35 IC1.4
  Bottom 0.305: U$1.18 14.05,23.65 v14.3,23.4
RST  (via drill 0.4)
  Top 0.305: X3.5 42.95,3.85 38.15,8.65 38.15,9.6 36.9,10.85 34.53,10.85 v31.82,13.56
  Bottom 0.305: U$1.48 22.1,21.15 R34.1 23.65,19.25 27.7,15.2 30.18,15.2 v31.82,13.56
RTS  (via drill 0.4)
  Top 0.305: v15.2,24.9 15.3,24.8 15.9,24.8 18.4,22.3 18.4,13.75 17.75,13.1 IC1.8
  Bottom 0.305: U$1.20 14.95,24.65 v15.2,24.9
SCL_FM  (via drill 0.4)
  Top 0.305: v22.8,27.2 20.13,29.87 v19.81,29.87
  Bottom 0.305: U$1.35 17.85,29.25 18.47,29.87 v19.81,29.87 19.81,30.61 20,30.8 R1.1 | v22.8,27.2 23.18,26.82 U$17.6
SDA_FM
  Bottom 0.305: 18.35,28.05 U$1.36 18.35,28.91 18.57,29.13 20.12,29.13 R5.1 | R5.1 20.9,28.65 | U$17.5 23.3,25.55 20.55,28.3 R5.1
SIM_VCC
  Top 0.254: 34,26.75 C13.2
  Top 0.305: 34,26.75 34.85,26.75 36.05,27.95 38.58,27.95 | 38.58,27.95 U$3.VCC | 38.58,27.95 38.58,30.13 U$8.3
  Top 0.406: IC1.30 33.5,27 C13.2
SIMLOCK_CLK  (via drill 0.4)
  Top 0.305: U$3.CLK 43.58,28.67 41.7,30.55 U$8.4 40.25,29.9 v40.25,29.5 | U$18.2 37.3,30.8 37.6,30.5 v37.6,29.4
  Bottom 0.305: v37.6,29.4 40.15,29.4 v40.25,29.5
SIMLOCK_IO  (via drill 0.4)
  Top 0.254: U$3.IO 45.1,13.66 45.1,25.9
  Top 0.305: U$3.IO 43.58,9.87 C14.2 | 45.1,25.9 44.55,26.45 44.55,29.1 v42.45,31.2 U$8.5 | U$18.1 36.58,29.93 v36.6,29.9
  Bottom 0.305: v42.45,31.2 42,31.2 41,30.2 36.9,30.2 v36.6,29.9
SIMLOCK_RST  (via drill 0.4)
  Top 0.305: U$18.3 37.6,31.6 38.55,32.55 40.2,32.55 U$8.6 42,31.85 42.15,32 42.85,32 v43.6,31.25 | U$3.RST 41.04,29.04 v41.4,29.4
  Bottom 0.305: v41.4,29.4 42.25,30.25 42.6,30.25 v43.6,31.25
STATUS  (via drill 0.4)
  Top 0.305: v11.3,29 11.3,24.7 10.6,24.7 9.8,23.9 v9.8,23.3
  Bottom 0.305: U$1.16 10.35,22.65 v9.8,23.3 | v11.3,29 11.3,29.4 9.6,31.1 LED1.A 10.37,31.15 10.58,31.36 10.58,33.99 TP6.TP
TEST  (via drill 0.4)
  Top 0.305: v31.95,15.65 31.95,15.5 35.4,12.05 37.4,12.05 39.35,10.1 39.35,9.25 42.62,5.98 43.79,5.98 44.2,5.57 X3.4
  Bottom 0.305: U$1.47 24.45,21.65 | 24.45,21.65 25.4,20.7 27.2,20.7 28.3,19.6 28.3,19.1 31.75,15.65 v31.95,15.65 | 24.45,21.65 25.75,22.95 R35.1
TS
  Top 0.254: 27.9,2.4 X4.1
  Top 0.305: U$6.1 22.7,5.7 24.6,5.7 27.9,2.4
  Bottom 0.254: 27.9,2.1 X4.1
  Bottom 0.305: 27.9,2.1 R14.1
VBAT  (via drill 0.5)
  Top 0.813: IC1.56 7.75,26.8 | 7.75,26.8 U$10.2 4.05,26.9 4.15,27 C26.1 4.15,30.25 C21.1 5,31.9 v5.4,32.3 5.7,32.6 v5.7,33.1 | IC1.55 IC1.57 7.95,26.6 7.75,26.8
  Bottom 0.305: 5,31 C20.1
  Bottom 0.813: C20.1 C16.1 C15.1 | 5,31 5,31.9 v5.4,32.3 5.7,32.6 v5.7,33.1
VIN  (via drill 0.4, 0.5)
  Top 0.254: 21.2,9.5 21,9.7
  Top 0.305: 21.2,9.5 U$6.5
  Top 0.406: v17.2,9.7 21,9.7 25.5,9.7 25.7,9.9 29.9,9.9 30.2,9.6 35.74,9.6 36.04,9.3 v36.04,9.22 v36.03,9.21 | v17.2,8.1 17.2,7.22 | U3.1 9.85,3.17 9.9,3.12 | U3.3 7.95,3.2 8.03,3.12
  Top 0.813: C28.1 12.9,4.1 | 12.9,4.1 16.02,7.22 17.2,7.22 U$6.10 | 4.2,12.12 R21.2 | R21.2 4.83,12.18 4.87,12.22 | 4.87,12.23 5.9,11.2 5.9,3.99 6.77,3.12 8.03,3.12 9.9,3.12 11.92,3.12 12.9,4.1 | 4.87,12.23 4.84,12.2 R21.2 | 4.87,12.23 5,12.36 Q4.2
  Bottom 0.406: v17.2,8.1 v17.2,9.7 | U1.1 42.81,10.33 42.36,10.78 40.16,10.78 39.51,10.13 C6.1 | C6.1 38.31,10.13 | C6.1 C3.1 36.66,9.22 v36.04,9.22
VRTC
  Top 0.406: IC1.26 33.5,23 C12.2

### Text on the board
Top: 1
Bottom: 2
tmine: gps | gsm | 10KOhm / ts | 3.7V / bat | 5V | debug
bmine: status | tp6 | tp2 | tp1 | tp4 | tp3 | tp5 | +3V3 | +2V8 | github.com/rodan/tracy | Petre Rodan 201411 rev2.1